# Altium schematic sheet Power_meter.SchDoc
size A4
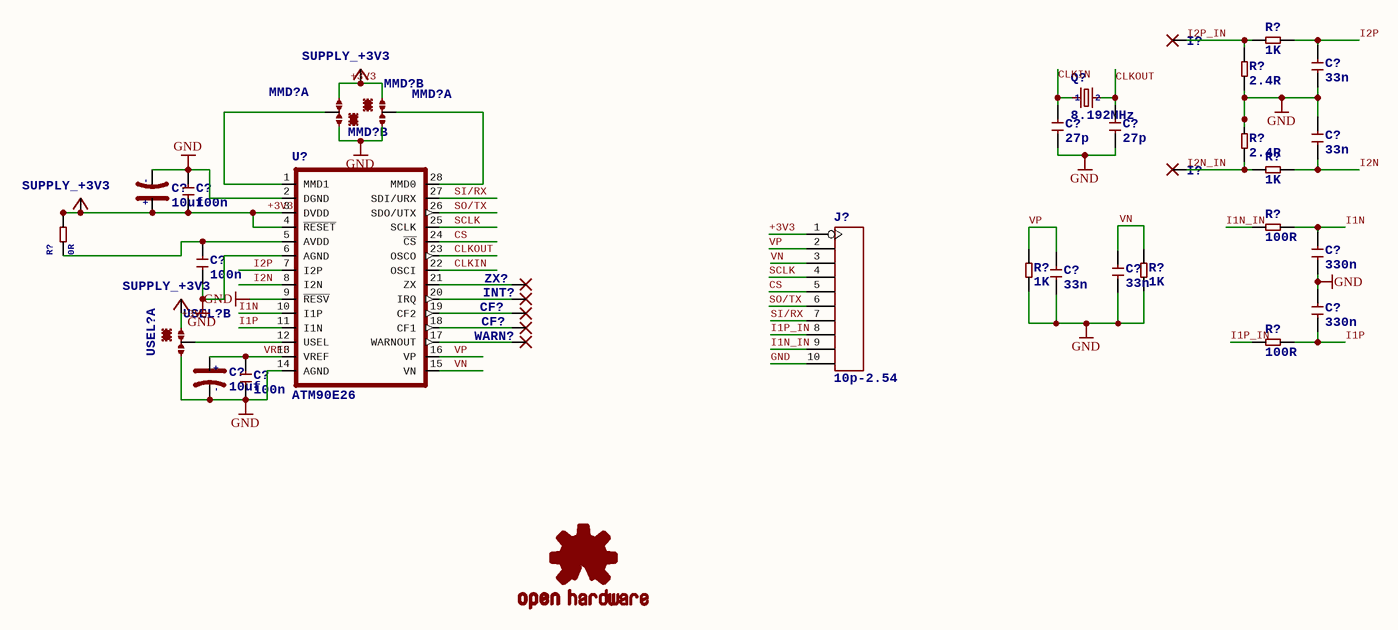
[diagram p0: Power_meter.SchDoc]

## Parts
(Parts that share a designator on the sheet are numbered #1, #2 ... from top to bottom, then left to right.)
+?#1  SUPPLY_+3V3
+?#2  SUPPLY_+3V3
+?#3  SUPPLY_+3V3
C?#1  33n  [C0603]
C?#2  27p  [C0603]
C?#3  27p  [C0603]
C?#4  33n  [C0603]
C?#5  10uf  [AVX-A]
C?#6  100n  [C0603]
C?#7  330n  [C0603]
C?#8  100n  [C0603]
C?#9  33n  [C0603]
C?#10  33n  [C0603]
C?#11  330n  [C0603]
C?#12  10uf  [AVX-A]
C?#13  100n  [C0603]
CF?#1  WIREPADSMD1,27-254  [SMD1,27-2,54]  (value not drawn)
CF?#2  WIREPADSMD1,27-254  [SMD1,27-2,54]  (value not drawn)
I?#1  WIREPADSMD1,27-254  [SMD1,27-2,54]  (value not drawn)
I?#2  WIREPADSMD1,27-254  [SMD1,27-2,54]  (value not drawn)
INT?  WIREPADSMD1,27-254  [SMD1,27-2,54]  (value not drawn)
J?  10p-2.54  [H10-2.54]
LOGO?  OSHW-LOGOM  [OSHW-LOGO-M]  (value not drawn)
MMD?#1  0R-JUMPA  [A0R-JMP]  (value not drawn)  (part B of 2)
MMD?#2  0R-JUMPA  [A0R-JMP]  (value not drawn)  (part A of 2)
MMD?#3  0R-JUMPA  [A0R-JMP]  (value not drawn)  (part A of 2)
MMD?#4  0R-JUMPA  [A0R-JMP]  (value not drawn)  (part B of 2)
Q?  8.192MHz  [HC49UP]
R?#1  1K  [R0603]
R?#2  2.4R  [R0603]
R?#3  2.4R  [R0603]
R?#4  1K  [R0603]
R?#5  100R  [R0603]
R?#6  0R  [R0603]
R?#7  1K  [R0603]
R?#8  1K  [R0603]
R?#9  100R  [R0603]
U?  ATM90E26  [SSOP-28]
USEL?#1  0R-JUMPA  [A0R-JMP]  (value not drawn)  (part B of 2)
USEL?#2  0R-JUMPA  [A0R-JMP]  (value not drawn)  (part A of 2)
WARN?  WIREPADSMD1,27-254  [SMD1,27-2,54]  (value not drawn)
ZX?  WIREPADSMD1,27-254  [SMD1,27-2,54]  (value not drawn)

## Nets
GND: C?#1.2 C?#2.2 C?#3.2 C?#4.1 C?#5.- C?#6.2 C?#7.2 C?#8.1 C?#9.1 C?#10.1 C?#11.1 C?#12.- C?#13.1 J?.10 MMD?#2.1 MMD?#3.3 R?#2.2 R?#3.1 R?#7.1 R?#8.1 U?.2(DGND) U?.6(AGND) U?.9(~{RESV}) U?.14(AGND) USEL?#2.3
+3V3: +?#1.?1(+3V3) +?#2.?1(+3V3) +?#3.?1(+3V3) C?#5.+ C?#6.1 J?.1 MMD?#2.3 MMD?#3.1 R?#6.2 U?.3(DVDD) U?.4(~{RESET}) USEL?#2.1
CLKIN: C?#2.1 Q?.1 U?.22(OSCI)
CLKOUT: C?#3.1 Q?.2 U?.23(OSCO)
CS: J?.5 U?.24(~{CS})
I1N: C?#7.1 R?#5.1 U?.10(I1P)
I1N_IN: J?.9 R?#5.2
I1P: C?#11.2 R?#9.1 U?.11(I1N)
I1P_IN: J?.8 R?#9.2
I2N: C?#4.2 R?#4.1 U?.8(I2N)
I2N_IN: I?#2.1(P) R?#3.2 R?#4.2
I2P: C?#1.1 R?#1.1 U?.7(I2P)
I2P_IN: I?#1.1(P) R?#1.2 R?#2.1
SCLK: J?.4 U?.25(SCLK)
SI/RX: J?.7 U?.27(SDI/URX)
SO/TX: J?.6 U?.26(SDO/UTX)
VN: C?#10.2 J?.3 R?#8.2 U?.15(VN)
VP: C?#9.2 J?.2 R?#7.2 U?.16(VP)
VREF: C?#12.+ C?#13.2 U?.13(VREF)
NetC?#8_2: C?#8.2 R?#6.1 U?.5(AVDD)
NetCF?#1_1: CF?#1.1(P) U?.19(CF2)
NetCF?#2_1: CF?#2.1(P) U?.18(CF1)
NetINT?_1: INT?.1(P) U?.20(IRQ)
NetMMD?#2_2: MMD?#2.2 U?.1(MMD1)
NetMMD?#3_2: MMD?#3.2 U?.28(MMD0)
NetU?_12: U?.12(USEL) USEL?#2.2
NetU?_17: U?.17(WARNOUT) WARN?.1(P)
NetU?_21: U?.21(ZX) ZX?.1(P)

## Library data of the parts
C?#1-C?#4 C?#6-C?#11 C?#13 = C*-0603: Ceramic Capacitors; CNAME: ATM90E26 Breakout; CREVISION: 0.1; DESIGNER: Tisham Dhar
C?#5 C?#12 = TANTALUM-SMD-22UF-10V(AVX-A): 302020008; MPN: TAJA226*010#NJ; CNAME: ATM90E26 Breakout; CREVISION: 0.1; DESIGNER: Tisham Dhar; VALUE: 22uf; +: +; -: -
CF?#1 CF?#2 I?#1 I?#2 INT? WARN? ZX? = WIREPADSMD1,27-254: Wire PAD connect wire on PCB
J? = DIP-BLACK-MALE-HEADER-VERT(10P-2.54): 320020050; MPN: P125-1110A0BS116AX; CNAME: ATM90E26 Breakout; CREVISION: 0.1; DESIGNER: Tisham Dhar; VALUE: 10p-2.54
LOGO? = OSHW-LOGOM: Open Source Hardware Logo This logo indicates the piece of hardware it is found on incorporates a OSHW license and/or adheres to the definition of open source hardware found here: http://freedomdefined.org/OSHW; CNAME: ATM90E26 Breakout; CREVISION: 0.1; DESIGNER: Tisham Dhar
MMD?#1-MMD?#4 USEL?#1 USEL?#2 = 0R-JUMPA: SMD 0R 0805 Jumper; CNAME: ATM90E26 Breakout; CREVISION: 0.1; DESIGNER: Tisham Dhar
Q? = CRYSTALHC49UP: CRYSTAL; CNAME: ATM90E26 Breakout; CREVISION: 0.1; DESIGNER: Tisham Dhar; OC_FARNELL: unknown; OC_NEWARK: unknown; 1: 1; 2: 2
R?#1 R?#4 R?#7 R?#8 = SMD-RES-1K(0603): 301010298; MPN: RC0603FR-071KL; CNAME: ATM90E26 Breakout; CREVISION: 0.1; DESIGNER: Tisham Dhar; VALUE: 1K
R?#2 R?#3 R?#5 R?#9 = SMD-RES-1K(0603): 301010298; MPN: RC0603FR-071KL; CNAME: ATM90E26 Breakout; CREVISION: 0.1; DESIGNER: Tisham Dhar; VALUE: 1K
R?#6 = SMD-RES-0R(0603): 301010292
U? = ATM90E26: Single-Phase High-Per formance Wide-Span Energy Metering IC; CNAME: ATM90E26 Breakout; CREVISION: 0.1; DESIGNER: Tisham Dhar